# Altium schematic sheet 4_FPGA_Banks_0_2.SchDoc
size A4; Organization: SpaceLab UFSC; Address1: UFSC - SpaceLab; Address2: University Campus - Trindade; Address3: Dep. of Electrical Engineering - CTC; Address4: Florianópolis, Santa Catarina, Brazil; Address5: CEP: 88040 - 900
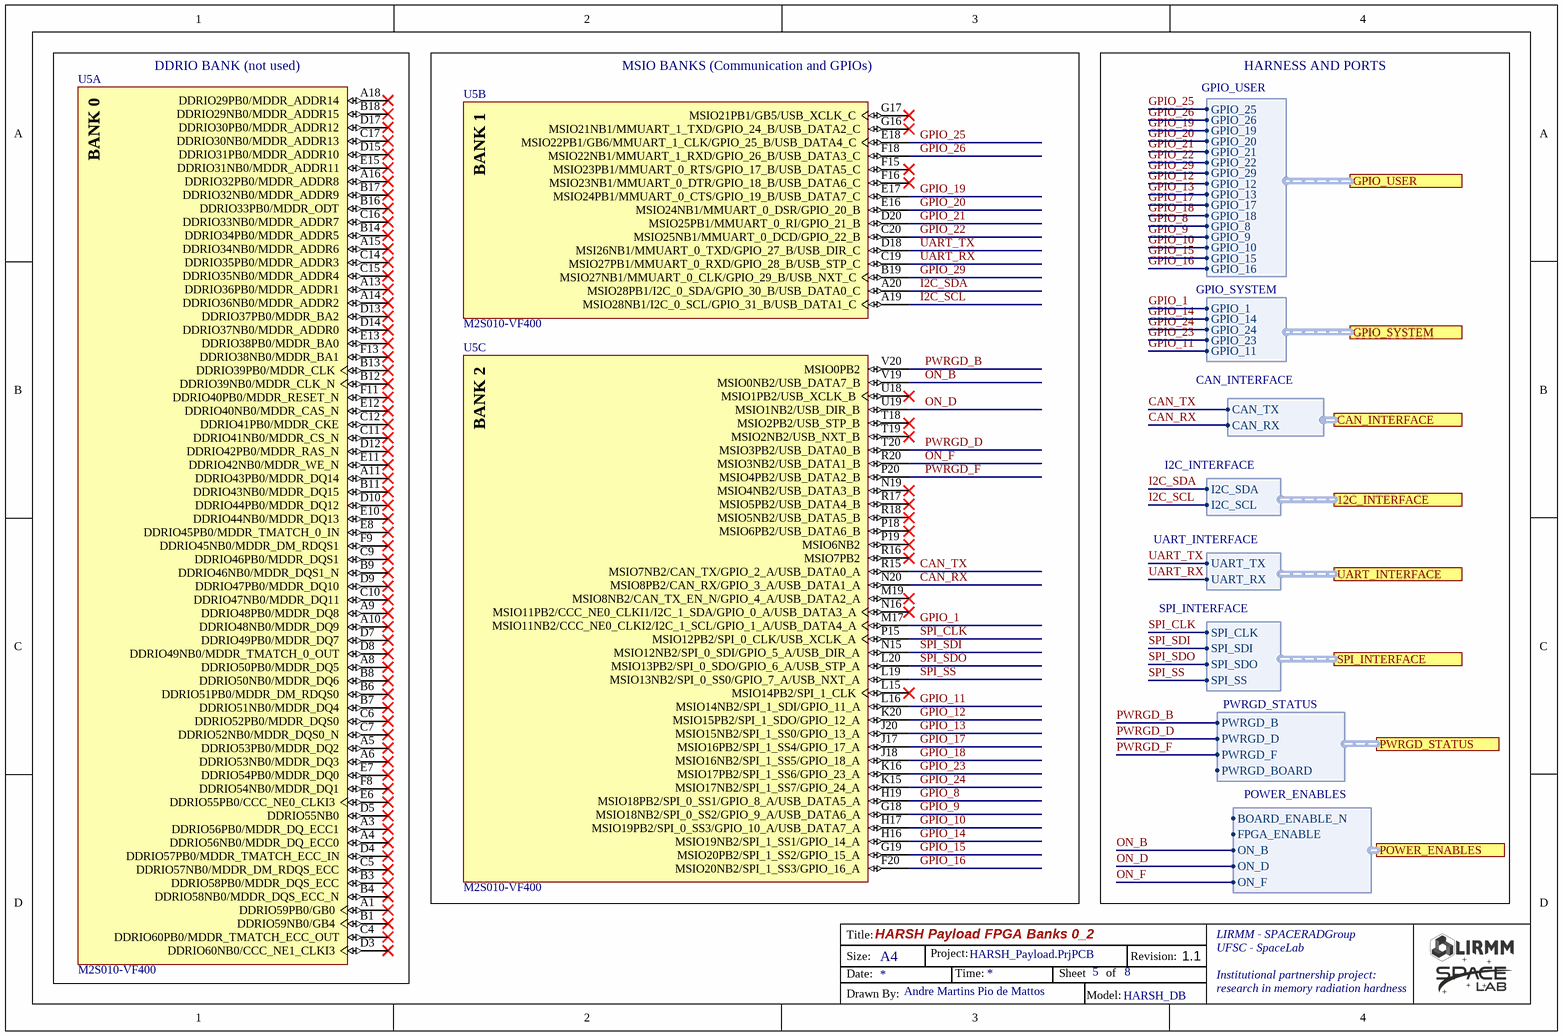
[diagram p0: 4_FPGA_Banks_0_2.SchDoc]

## Parts
U5  M2S010-VF400  [DONE_MCSM_VF_400]  (parts A,B,C of 14)

## Blocks framed on the sheet
DDRIO BANK (not used): U5
MSIO BANKS (Communication and GPIOs): U5

## Ports
12C_INTERFACE (harness I2C_INTERFACE), CAN_INTERFACE (harness CAN_INTERFACE), GPIO_SYSTEM (harness GPIO_SYSTEM), GPIO_USER (harness GPIO_USER), POWER_ENABLES (harness POWER_ENABLES), PWRGD_STATUS (harness PWRGD_STATUS), SPI_INTERFACE (harness SPI_INTERFACE), UART_INTERFACE (harness UART_INTERFACE)

## Harnesses
GPIO_USER: GPIO_25, GPIO_26, GPIO_19, GPIO_20, GPIO_21, GPIO_22, GPIO_29, GPIO_12, GPIO_13, GPIO_17, GPIO_18, GPIO_8, GPIO_9, GPIO_10, GPIO_15, GPIO_16
CAN_INTERFACE: CAN_TX, CAN_RX
GPIO_SYSTEM: GPIO_1, GPIO_14, GPIO_24, GPIO_23, GPIO_11
I2C_INTERFACE: I2C_SDA, I2C_SCL
UART_INTERFACE: UART_TX, UART_RX
SPI_INTERFACE: SPI_SDI, SPI_SDO, SPI_CLK, SPI_SS
PWRGD_STATUS: PWRGD_B, PWRGD_D, PWRGD_F, PWRGD_BOARD
POWER_ENABLES: FPGA_ENABLE, ON_B, BOARD_ENABLE_N, ON_D, ON_F

## Nets
CAN_RX: U5.N20(MSIO8PB2/CAN_RX/GPIO_3_A/USB_DATA1_A) ; port CAN_INTERFACE.CAN_RX
CAN_TX: U5.R15(MSIO7NB2/CAN_TX/GPIO_2_A/USB_DATA0_A) ; port CAN_INTERFACE.CAN_TX
GPIO_1: U5.M17(MSIO11NB2/CCC_NE0_CLKI2/I2C_1_SCL/GPIO_1_A/USB_DATA4_A) ; port GPIO_SYSTEM.GPIO_1
GPIO_8: U5.H19(MSIO18PB2/SPI_0_SS1/GPIO_8_A/USB_DATA5_A) ; port GPIO_USER.GPIO_8
GPIO_9: U5.G18(MSIO18NB2/SPI_0_SS2/GPIO_9_A/USB_DATA6_A) ; port GPIO_USER.GPIO_9
GPIO_10: U5.H17(MSIO19PB2/SPI_0_SS3/GPIO_10_A/USB_DATA7_A) ; port GPIO_USER.GPIO_10
GPIO_11: U5.L16(MSIO14NB2/SPI_1_SDI/GPIO_11_A) ; port GPIO_SYSTEM.GPIO_11
GPIO_12: U5.K20(MSIO15PB2/SPI_1_SDO/GPIO_12_A) ; port GPIO_USER.GPIO_12
GPIO_13: U5.J20(MSIO15NB2/SPI_1_SS0/GPIO_13_A) ; port GPIO_USER.GPIO_13
GPIO_14: U5.H16(MSIO19NB2/SPI_1_SS1/GPIO_14_A) ; port GPIO_SYSTEM.GPIO_14
GPIO_15: U5.G19(MSIO20PB2/SPI_1_SS2/GPIO_15_A) ; port GPIO_USER.GPIO_15
GPIO_16: U5.F20(MSIO20NB2/SPI_1_SS3/GPIO_16_A) ; port GPIO_USER.GPIO_16
GPIO_17: U5.J17(MSIO16PB2/SPI_1_SS4/GPIO_17_A) ; port GPIO_USER.GPIO_17
GPIO_18: U5.J18(MSIO16NB2/SPI_1_SS5/GPIO_18_A) ; port GPIO_USER.GPIO_18
GPIO_19: U5.E17(MSIO24PB1/MMUART_0_CTS/GPIO_19_B/USB_DATA7_C) ; port GPIO_USER.GPIO_19
GPIO_20: U5.E16(MSIO24NB1/MMUART_0_DSR/GPIO_20_B) ; port GPIO_USER.GPIO_20
GPIO_21: U5.D20(MSIO25PB1/MMUART_0_RI/GPIO_21_B) ; port GPIO_USER.GPIO_21
GPIO_22: U5.C20(MSIO25NB1/MMUART_0_DCD/GPIO_22_B) ; port GPIO_USER.GPIO_22
GPIO_23: U5.K16(MSIO17PB2/SPI_1_SS6/GPIO_23_A) ; port GPIO_SYSTEM.GPIO_23
GPIO_24: U5.K15(MSIO17NB2/SPI_1_SS7/GPIO_24_A) ; port GPIO_SYSTEM.GPIO_24
GPIO_25: U5.E18(MSIO22PB1/GB6/MMUART_1_CLK/GPIO_25_B/USB_DATA4_C) ; port GPIO_USER.GPIO_25
GPIO_26: U5.F18(MSIO22NB1/MMUART_1_RXD/GPIO_26_B/USB_DATA3_C) ; port GPIO_USER.GPIO_26
GPIO_29: U5.B19(MSIO27NB1/MMUART_0_CLK/GPIO_29_B/USB_NXT_C) ; port GPIO_USER.GPIO_29
I2C_SCL: U5.A19(MSIO28NB1/I2C_0_SCL/GPIO_31_B/USB_DATA1_C) ; port 12C_INTERFACE.I2C_SCL
I2C_SDA: U5.A20(MSIO28PB1/I2C_0_SDA/GPIO_30_B/USB_DATA0_C) ; port 12C_INTERFACE.I2C_SDA
ON_B: U5.V19(MSIO0NB2/USB_DATA7_B) ; port POWER_ENABLES.ON_B
ON_D: U5.U19(MSIO1NB2/USB_DIR_B) ; port POWER_ENABLES.ON_D
ON_F: U5.R20(MSIO3NB2/USB_DATA1_B) ; port POWER_ENABLES.ON_F
PWRGD_B: U5.V20(MSIO0PB2) ; port PWRGD_STATUS.PWRGD_B
PWRGD_D: U5.T20(MSIO3PB2/USB_DATA0_B) ; port PWRGD_STATUS.PWRGD_D
PWRGD_F: U5.P20(MSIO4PB2/USB_DATA2_B) ; port PWRGD_STATUS.PWRGD_F
SPI_CLK: U5.P15(MSIO12PB2/SPI_0_CLK/USB_XCLK_A) ; port SPI_INTERFACE.SPI_CLK
SPI_SDI: U5.N15(MSIO12NB2/SPI_0_SDI/GPIO_5_A/USB_DIR_A) ; port SPI_INTERFACE.SPI_SDI
SPI_SDO: U5.L20(MSIO13PB2/SPI_0_SDO/GPIO_6_A/USB_STP_A) ; port SPI_INTERFACE.SPI_SDO
SPI_SS: U5.L19(MSIO13NB2/SPI_0_SS0/GPIO_7_A/USB_NXT_A) ; port SPI_INTERFACE.SPI_SS
UART_RX: U5.C19(MSIO27PB1/MMUART_0_RXD/GPIO_28_B/USB_STP_C) ; port UART_INTERFACE.UART_RX
UART_TX: U5.D18(MSI26NB1/MMUART_0_TXD/GPIO_27_B/USB_DIR_C) ; port UART_INTERFACE.UART_TX

Not connected (* = marked no-connect by the designer): U5 A1(DDRIO59PB0/GB0)* A3(DDRIO56PB0/MDDR_DQ_ECC1)* A4(DDRIO56NB0/MDDR_DQ_ECC0)* A5(DDRIO53PB0/MDDR_DQ2)* A6(DDRIO53NB0/MDDR_DQ3)* A8(DDRIO50PB0/MDDR_DQ5)* A9(DDRIO48PB0/MDDR_DQ8)* A10(DDRIO48NB0/MDDR_DQ9)* A11(DDRIO43PB0/MDDR_DQ14)* A13(DDRIO36PB0/MDDR_ADDR1)* A14(DDRIO36NB0/MDDR_ADDR2)* A15(DDRIO34NB0/MDDR_ADDR6)* A16(DDRIO32PB0/MDDR_ADDR8)* A18(DDRIO29PB0/MDDR_ADDR14)* B1(DDRIO59NB0/GB4)* B3(DDRIO58PB0/MDDR_DQS_ECC)* B4(DDRIO58NB0/MDDR_DQS_ECC_N)* B6(DDRIO51PB0/MDDR_DM_RDQS0)* B7(DDRIO51NB0/MDDR_DQ4)* B8(DDRIO50NB0/MDDR_DQ6)* B9(DDRIO46NB0/MDDR_DQS1_N)* B11(DDRIO43NB0/MDDR_DQ15)* B12(DDRIO39NB0/MDDR_CLK_N)* B13(DDRIO39PB0/MDDR_CLK)* B14(DDRIO34PB0/MDDR_ADDR5)* B16(DDRIO33PB0/MDDR_ODT)* B17(DDRIO32NB0/MDDR_ADDR9)* B18(DDRIO29NB0/MDDR_ADDR15)* C4(DDRIO60PB0/MDDR_TMATCH_ECC_OUT)* C5(DDRIO57NB0/MDDR_DM_RDQS_ECC)* C6(DDRIO52PB0/MDDR_DQS0)* C7(DDRIO52NB0/MDDR_DQS0_N)* C9(DDRIO46PB0/MDDR_DQS1)* C10(DDRIO47NB0/MDDR_DQ11)* C11(DDRIO41NB0/MDDR_CS_N)* C12(DDRIO41PB0/MDDR_CKE)* C14(DDRIO35PB0/MDDR_ADDR3)* C15(DDRIO35NB0/MDDR_ADDR4)* C16(DDRIO33NB0/MDDR_ADDR7)* C17(DDRIO30NB0/MDDR_ADDR13)* D3(DDRIO60NB0/CCC_NE1_CLKI3)* D4(DDRIO57PB0/MDDR_TMATCH_ECC_IN)* D5(DDRIO55NB0)* D7(DDRIO49PB0/MDDR_DQ7)* D8(DDRIO49NB0/MDDR_TMATCH_0_OUT)* D9(DDRIO47PB0/MDDR_DQ10)* D10(DDRIO44PB0/MDDR_DQ12)* D12(DDRIO42PB0/MDDR_RAS_N)* D13(DDRIO37PB0/MDDR_BA2)* D14(DDRIO37NB0/MDDR_ADDR0)* D15(DDRIO31PB0/MDDR_ADDR10)* D17(DDRIO30PB0/MDDR_ADDR12)* E6(DDRIO55PB0/CCC_NE0_CLKI3)* E7(DDRIO54PB0/MDDR_DQ0)* E8(DDRIO45PB0/MDDR_TMATCH_0_IN)* E10(DDRIO44NB0/MDDR_DQ13)* E11(DDRIO42NB0/MDDR_WE_N)* E12(DDRIO40NB0/MDDR_CAS_N)* E13(DDRIO38PB0/MDDR_BA0)* E15(DDRIO31NB0/MDDR_ADDR11)* F8(DDRIO54NB0/MDDR_DQ1)* F9(DDRIO45NB0/MDDR_DM_RDQS1)* F11(DDRIO40PB0/MDDR_RESET_N)* F13(DDRIO38NB0/MDDR_BA1)* F15(MSIO23PB1/MMUART_0_RTS/GPIO_17_B/USB_DATA5_C)* F16(MSIO23NB1/MMUART_0_DTR/GPIO_18_B/USB_DATA6_C)* G16(MSIO21NB1/MMUART_1_TXD/GPIO_24_B/USB_DATA2_C)* G17(MSIO21PB1/GB5/USB_XCLK_C)* L15(MSIO14PB2/SPI_1_CLK)* M19(MSIO8NB2/CAN_TX_EN_N/GPIO_4_A/USB_DATA2_A)* N16(MSIO11PB2/CCC_NE0_CLKI1/I2C_1_SDA/GPIO_0_A/USB_DATA3_A)* N19(MSIO4NB2/USB_DATA3_B)* P18(MSIO6PB2/USB_DATA6_B)* P19(MSIO6NB2)* R16(MSIO7PB2)* R17(MSIO5PB2/USB_DATA4_B)* R18(MSIO5NB2/USB_DATA5_B)* T18(MSIO2PB2/USB_STP_B)* T19(MSIO2NB2/USB_NXT_B)* U18(MSIO1PB2/USB_XCLK_B)*

## Notes on the sheet
- HARNESS AND PORTS
- HARSH Payload FPGA Banks 0_2
- HARSH_Payload.PrjPCB
- 5
- 8
- 1.1
- Andre Martins Pio de Mattos
- HARSH_DB
- Title:
- Size:
- Date:
- A4
- Project:
- Time:
- Sheet
- of
- Revision:
- LIRMM - SPACERADGroup
- UFSC - SpaceLab
- Institutional partnership project:
- research in memory radiation hardness
- Drawn By:
- Model:
- (in symbol DONE_M2S010-VF400, part A) BANK 0
- (in symbol DONE_M2S010-VF400, part B) BANK 1
- (in symbol DONE_M2S010-VF400, part C) BANK 2

## Library data of the parts
U5 = DONE_M2S010-VF400: SmartFusion2 SoC FPGA, ARM Cortex-M3, 10 K LUTs, 195 User I/O, Design Security, 0 to 85 degC, 400-Ball BGA; Manufacturer: Microsemi; DDR Controllers (Count x Width): 1x18; MSIO (3.3V): 99; PLLs and CCCs: 2; eSRAM (K Bytes) Non SECDED: 80; SERDES Lanes: 4; Total User I/O: 195; eSRAM (K Bytes): 64; uSRAM1K Blocks: 22; Maximum Logic Elements: 12,084; MSIOD (2.5V): 32; eNVM (K Bytes): 256; Total RAM (K bits): 400; LSRAM 18K Blocks: 21; PartNumber: M2S010-VF400; PackageVersion: Rev. 48, 11/2013; ComponentLink1Description: Manufacturer URL; ComponentLink2Description: Datasheet; DatasheetVersion: Rev. 5; ComponentLink3URL: http://www.microsemi.com/document-portal/doc_download/131095-package-mechanical-drawings; ComponentLink1URL: http://www.microsemi.com/; ComponentLink2URL: http://www.microsemi.com/document-portal/doc_download/130717-smartfusion2-datasheet; PackageReference: VF-400; ComponentLink3Description: Package Specification; Math Blocks (18x18): 22; RoHS: FALSE; DDRIO (2.5V): 64; Mounting Technology: Surface Mount; PackageDescription: 400-Ball Very Fine Pitch Ball Grid Array, Body 17 x 17 mm, Pitch 0.8 mm